# EAGLE design 5V (EAGLE 5.10)
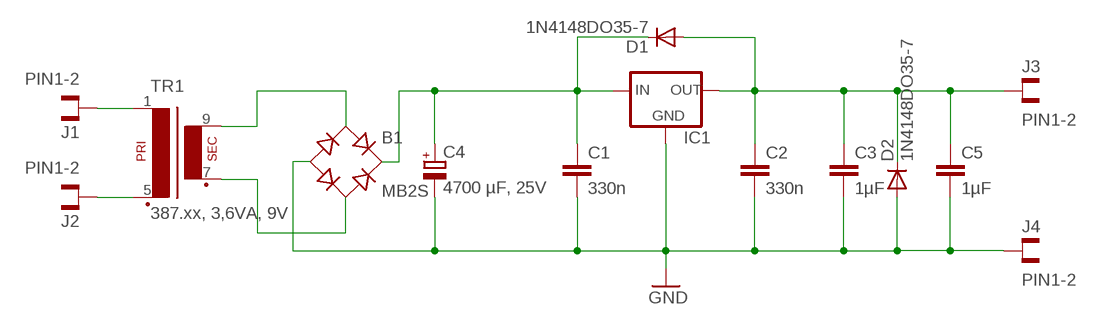
[diagram p0: schematic, sheet 1]

## Parts
B1  MB2S  [SOIC-4]
C1  330n  C-EUC0805  [C0805]
C2  330n  C-EUC0805  [C0805]
C3  1µF  C-EUC0805  [C0805]
C4  4700 µF, 25V  CPOL-EUE7.5-18  [E7,5-18]
C5  1µF  C-EUC0805  [C0805]
D1  1N4148DO35-7  [DO35-7]
D2  1N4148DO35-7  [DO35-7]
IC1  78XXL  [78XXL]
J1  PIN1-2  [62221]
J2  PIN1-2  [62221]
J3  PIN1-2  [62221]
J4  PIN1-2  [62221]
TR1  387.xx, 3,6VA, 9V  EI30-1  [EI30-1]

## Nets
GND: B1.- C1.2 C2.2 C3.2 C4.- C5.2 D2.A IC1.GND J4.1
N$1: B1.~1(AC1) TR1.9(S4)
N$2: B1.~2(AC2) TR1.7(S3)
N$3: B1.+ C1.1 C4.+ D1.C IC1.IN
N$4: C2.1 C3.1 C5.1 D1.A D2.C IC1.OUT J3.1
N$7: J2.1 TR1.5(P2)
N$8: J1.1 TR1.1

## Library data of the parts
B1 = rectifier:MB*S: Bridge Rectifier Source: http://www.fairchildsemi.com/ds/MB/MB6S.pdf
C1-C3 C5 = rcl:C-EU: CAPACITOR, European symbol
C4 = rcl:CPOL-EU: POLARIZED CAPACITOR, European symbol
D1 D2 = diode:1N4148: DIODE high speed (Philips)
IC1 = v-reg:78XXL: VOLTAGE REGULATOR
J1-J4 = con-faston:PIN1-2: CONN TAB FASTON BRASS .187 PCB TAB, FSSTON, DUAL STAKE, .187 SERIES Digi-Key Part Number: A24734CT-ND Source: Tyco Electronics Corporation .. ENG_CD_62221_R.pdf http://search.digikey.com/scripts/DkSearch/dksus.dll?Detail&name=A24734CT-ND
TR1 = trafo:EI30-1: TRANSFORMER 1 primary winding, 1 secondary winding ERA

## Board
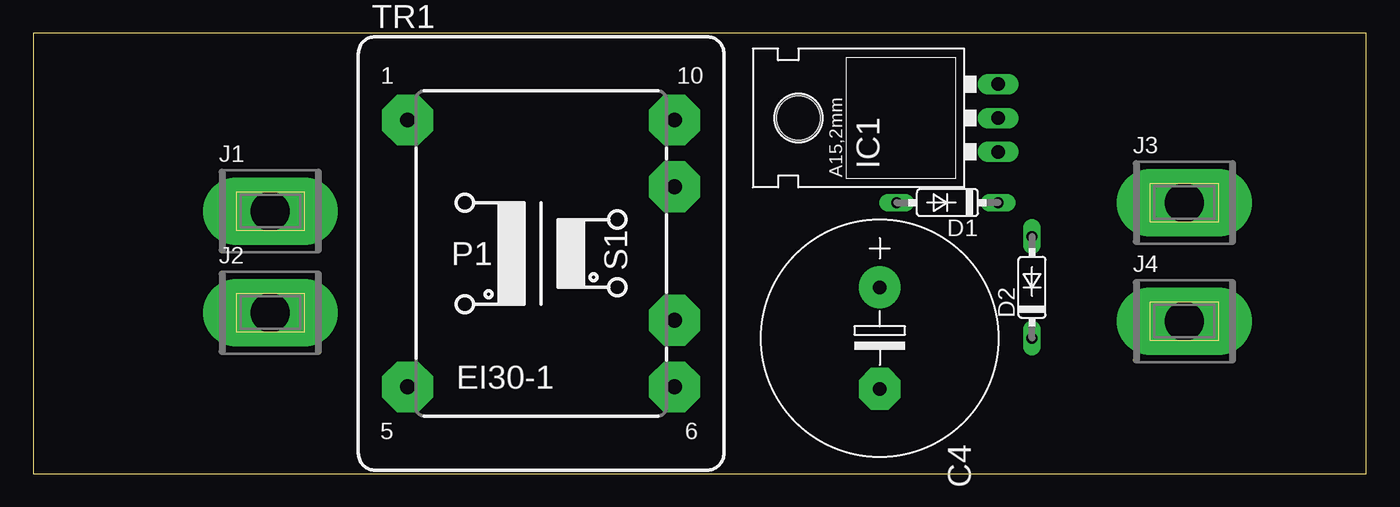
[diagram p1: board, top side]
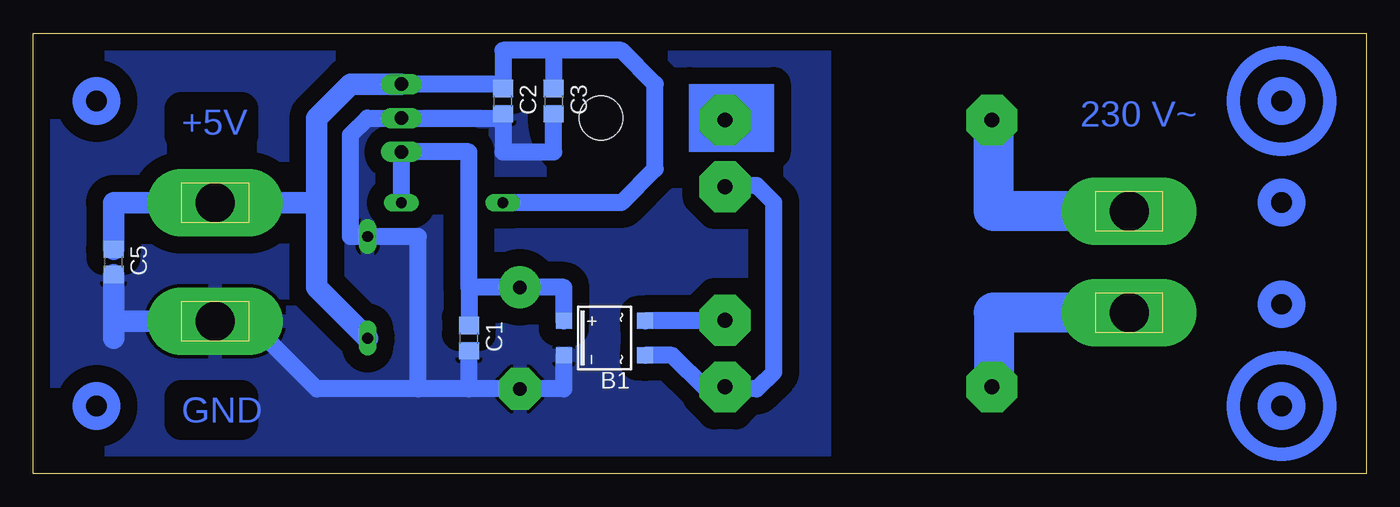
[diagram p2: board, bottom side, seen from below]

Size 100 x 33.01 mm. Coordinates in mm from the lower left corner, seen from the top.
Outline: 0,0 100,0 100,33.01 0,33.01 0,0
Copper layers (1*16): Top 0.035mm / dielectric 1.5mm / Bottom 0.035mm
Design rules "default": minimum track width 10mil, minimum drill 24mil, track to track 8mil, track to pad 8mil, pad to pad 8mil, via to via 8mil, smd to smd 8mil, copper to edge 40mil, drill to drill 8mil, minimum pad ring 10mil, minimum via ring 8mil, stop-mask expansion 4mil, vias tented up to drill 0mil, thermal gap 10mil

### Footprints (pad centres in the part's own frame; a part is rotated, then mirrored left to right if it is on the bottom)
SOIC-4 = smd 1.2 x 1.2: + 1.3,3.05; - -1.3,3.05; ~1 -1.3,-3.05; ~2 1.3,-3.05
C0805 = smd 1.3 x 1.5: 1 -0.95,0; 2 0.95,0
E7,5-18 = drill 1.016 pad 3.15 round: + -3.81,0 | drill 1.016 pad 3.15 octagon: - 3.81,0
DO35-7 = drill 0.813 long: A 3.81,0; C -3.81,0
78XXL = drill 1.016 long: GND 0,-3.81; IN -2.54,-3.81; OUT 2.54,-3.81 | hole 3.302: 0,11.176
62221 = drill 2.921 pad 5.08 long: 1 0,0
EI30-1 = drill 1.118 pad 3.81 octagon: 1 -10.008,10.008; 5 -10.008,-10.008; 6 10.008,-10.008; 7 10.008,-5.004; 9 10.008,5.004; 10 10.008,10.008

### Placement (x,y rotation side)
B1  57.15,10.16 90 bottom
C1  67.31,10.16 270 bottom
C2  64.77,27.94 270 bottom
C3  60.96,27.94 270 bottom
C4  63.5,10.16 270 top
C5  93.98,15.88 270 bottom
D1  68.58,20.32 180 top
D2  74.93,13.97 90 top
IC1  68.58,26.67 90 top
J1  17.78,19.68 0 top
J2  17.78,12.06 0 top
J3  86.36,20.32 0 top
J4  86.36,11.43 0 top
TR1  38.1,16.51 0 top

### Tracks (layer width: path | path; a pad name or v marks a point on that pad's centre or on a via)
GND
  Bottom 1.27: 67.31,6.35 C4.- 60.2,6.35 B1.- | 67.31,6.35 C1.2 | C3.2 60.96,24.13 64.77,24.13 C2.2 64.77,26.67 IC1.GND 74.93,26.67 76.2,25.4 76.2,17.78 D2.A 71.12,17.78 71.12,6.35 | 67.31,6.35 71.12,6.35 | 71.12,6.35 78.74,6.35 83.82,11.43 J4.1
  Bottom 1.6: 93.98,11.43 C5.2 | 93.98,11.43 93.98,10.16 | J4.1 93.98,11.43
  pour Bottom (isolate 1.27): 40.64,0 40.64,31.75 100.33,31.75 100.33,0
N$1
  Bottom 1.27: B1.~1 52.07,8.86 49.53,6.35 45.72,6.35 44.45,7.62 44.45,20.32 45.72,21.59 48.11,21.59 TR1.9
N$2
  Bottom 1.27: B1.~2 48.11,11.46 TR1.7
N$3
  Bottom 1.27: 67.31,13.97 C1.1 | 67.31,13.97 67.31,24.13 IC1.IN D1.C | 67.31,13.97 C4.+ 60.2,13.97 B1.+
N$4
  Bottom 1.27: 64.77,29.21 64.77,31.75 60.96,31.75 | 60.96,31.75 C3.1 | 64.77,29.21 IC1.OUT | 64.77,29.21 C2.1 | D1.A 55.88,20.32 53.34,22.86 53.34,29.21 55.88,31.75 60.96,31.75
  Bottom 1.6: IC1.OUT 76.2,29.21 78.74,26.67 78.74,20.32 | 78.74,20.32 78.74,13.97 D2.C | 78.74,20.32 J3.1 93.98,20.32 C5.1
N$7
  Bottom 3: J2.1 27.94,12.06 27.94,6.35 28.09,6.35 TR1.5
N$8
  Bottom 2.54: 28.09,26.67 TR1.1
  Bottom 3: J1.1 27.94,19.68 27.94,26.67 28.09,26.67
(copper drawn outside any net)
  shapes: Bottom area x1, Bottom circle x8

### Text on the board
Bottom: 230 V~ | +5V | GND